# Altium schematic sheet PIC.Schematic.SchDoc
size A
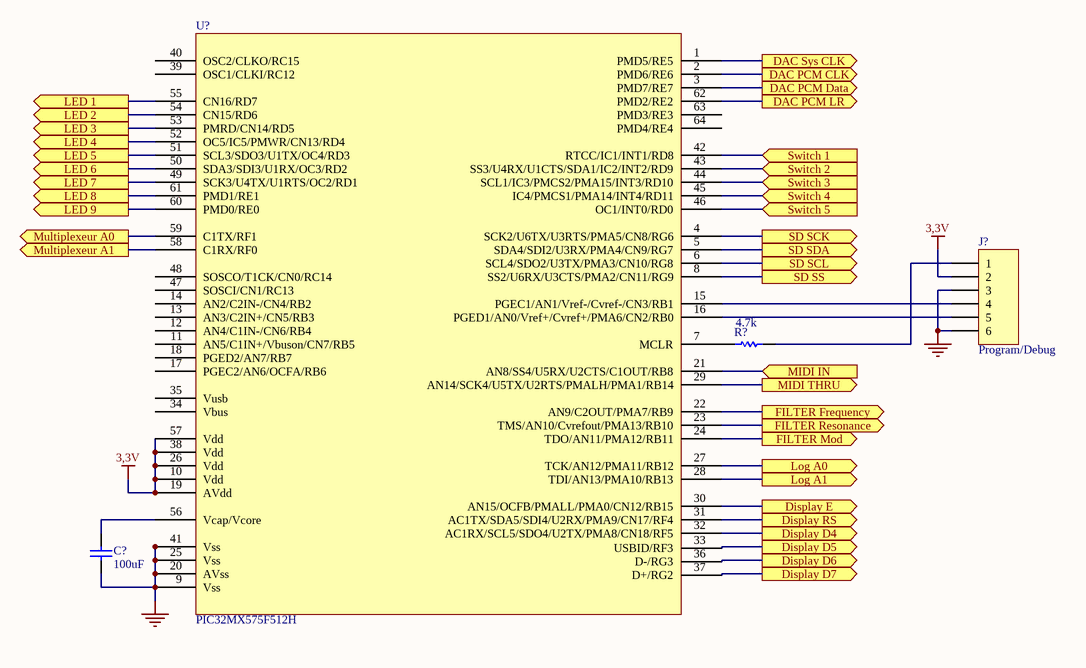
[diagram p0: PIC.Schematic.SchDoc]

## Parts
C?  value 100uF  [RAD-0.3]  (hidden comment: Cap)
J?  Program/Debug  [HDR1X6H]
R?  value 4.7k  [AXIAL-0.3]  (hidden comment: Res1)
U?  PIC32MX575F512H

## Ports
DAC PCM CLK (out), DAC PCM Data (out), DAC PCM LR (out), DAC Sys CLK (out), Display D4 (out), Display D5 (out), Display D6 (out), Display D7 (out), Display E (out), Display RS (out), FILTER Frequency (out), FILTER Mod (out), FILTER Resonance (out), LED 1 (out), LED 2 (out), LED 3 (out), LED 4 (out), LED 5 (out), LED 6 (out), LED 7 (out), LED 8 (out), LED 9 (out), Log A0 (out), Log A1 (out), MIDI IN (in), MIDI THRU (out), Multiplexeur A0 (out), Multiplexeur A1 (out), SD SCK (out), SD SCL (out), SD SDA (out), SD SS (out), Switch 1 (in), Switch 2 (in), Switch 3 (in), Switch 4 (in), Switch 5 (in)

## Nets
3,3V: J?.2 U?.10(Vdd) U?.19(AVdd) U?.26(Vdd) U?.38(Vdd) U?.57(Vdd)
GND: C?.1 J?.3 J?.6 U?.9(Vss) U?.20(AVss) U?.25(Vss) U?.41(Vss)
DAC PCM CLK: U?.2(PMD6/RE6) ; port DAC PCM CLK
DAC PCM Data: U?.3(PMD7/RE7) ; port DAC PCM Data
DAC PCM LR: U?.62(PMD2/RE2) ; port DAC PCM LR
DAC Sys CLK: U?.1(PMD5/RE5) ; port DAC Sys CLK
Display D4: U?.32(AC1RX/SCL5/SDO4/U2TX/PMA8/CN18/RF5) ; port Display D4
Display D5: U?.33(USBID/RF3) ; port Display D5
Display D6: U?.36(D-/RG3) ; port Display D6
Display D7: U?.37(D+/RG2) ; port Display D7
Display E: U?.30(AN15/OCFB/PMALL/PMA0/CN12/RB15) ; port Display E
Display RS: U?.31(AC1TX/SDA5/SDI4/U2RX/PMA9/CN17/RF4) ; port Display RS
FILTER Frequency: U?.22(AN9/C2OUT/PMA7/RB9) ; port FILTER Frequency
FILTER Mod: U?.24(TDO/AN11/PMA12/RB11) ; port FILTER Mod
FILTER Resonance: U?.23(TMS/AN10/Cvrefout/PMA13/RB10) ; port FILTER Resonance
LED 1: U?.55(CN16/RD7) ; port LED 1
LED 2: U?.54(CN15/RD6) ; port LED 2
LED 3: U?.53(PMRD/CN14/RD5) ; port LED 3
LED 4: U?.52(OC5/IC5/PMWR/CN13/RD4) ; port LED 4
LED 5: U?.51(SCL3/SDO3/U1TX/OC4/RD3) ; port LED 5
LED 6: U?.50(SDA3/SDI3/U1RX/OC3/RD2) ; port LED 6
LED 7: U?.49(SCK3/U4TX/U1RTS/OC2/RD1) ; port LED 7
LED 8: U?.61(PMD1/RE1) ; port LED 8
LED 9: U?.60(PMD0/RE0) ; port LED 9
Log A0: U?.27(TCK/AN12/PMA11/RB12) ; port Log A0
Log A1: U?.28(TDI/AN13/PMA10/RB13) ; port Log A1
MIDI IN: U?.21(AN8/SS4/U5RX/U2CTS/C1OUT/RB8) ; port MIDI IN
MIDI THRU: U?.29(AN14/SCK4/U5TX/U2RTS/PMALH/PMA1/RB14) ; port MIDI THRU
Multiplexeur A0: U?.59(C1TX/RF1) ; port Multiplexeur A0
Multiplexeur A1: U?.58(C1RX/RF0) ; port Multiplexeur A1
SD SCK: U?.4(SCK2/U6TX/U3RTS/PMA5/CN8/RG6) ; port SD SCK
SD SCL: U?.6(SCL4/SDO2/U3TX/PMA3/CN10/RG8) ; port SD SCL
SD SDA: U?.5(SDA4/SDI2/U3RX/PMA4/CN9/RG7) ; port SD SDA
SD SS: U?.8(SS2/U6RX/U3CTS/PMA2/CN11/RG9) ; port SD SS
Switch 1: U?.42(RTCC/IC1/INT1/RD8) ; port Switch 1
Switch 2: U?.43(SS3/U4RX/U1CTS/SDA1/IC2/INT2/RD9) ; port Switch 2
Switch 3: U?.44(SCL1/IC3/PMCS2/PMA15/INT3/RD10) ; port Switch 3
Switch 4: U?.45(IC4/PMCS1/PMA14/INT4/RD11) ; port Switch 4
Switch 5: U?.46(OC1/INT0/RD0) ; port Switch 5
NetC?_2: C?.2 U?.56(Vcap/Vcore)
NetJ?_1: J?.1 R?.2
NetJ?_4: J?.4 U?.15(PGEC1/AN1/Vref-/Cvref-/CN3/RB1)
NetJ?_5: J?.5 U?.16(PGED1/AN0/Vref+/Cvref+/PMA6/CN2/RB0)
NetR?_1: R?.1 U?.7(MCLR)

Not connected (* = marked no-connect by the designer): U? 11(AN5/C1IN+/Vbuson/CN7/RB5) 12(AN4/C1IN-/CN6/RB4) 13(AN3/C2IN+/CN5/RB3) 14(AN2/C2IN-/CN4/RB2) 17(PGEC2/AN6/OCFA/RB6) 18(PGED2/AN7/RB7) 34(Vbus) 35(Vusb) 39(OSC1/CLKI/RC12) 40(OSC2/CLKO/RC15) 47(SOSCI/CN1/RC13) 48(SOSCO/T1CK/CN0/RC14) 63(PMD3/RE3) 64(PMD4/RE4)

## Library data of the parts
C? = Cap: Capacitor; Published: 8-Jun-2000; LatestRevisionDate: 17-Jul-2002; LatestRevisionNote: Re-released for DXP Platform.; PackageReference: RAD-0.3; Publisher: Altium Limited; PackageDescription: Radial Cap, Thru-Hole; 2 Leads; 0.3 in Pin Spacing
J? = Header 6H: Header, 6-Pin, Right Angle; LatestRevisionDate: 17-Jul-2002; LatestRevisionNote: Re-released for DXP Platform.; Publisher: Altium Limited
R? = Res1: Resistor; Published: 8-Jun-2000; LatestRevisionDate: 17-Jul-2002; LatestRevisionNote: Re-released for DXP Platform.; PackageReference: AXIAL-0.3; Publisher: Altium Limited; PackageDescription: Axial Device, Thru-Hole; 2 Leads; 0.3 in Pin Spacing
U? = PIC32 MX575F512H